# Altium schematic sheet wifi_watering_system_1.SchDoc
size A4
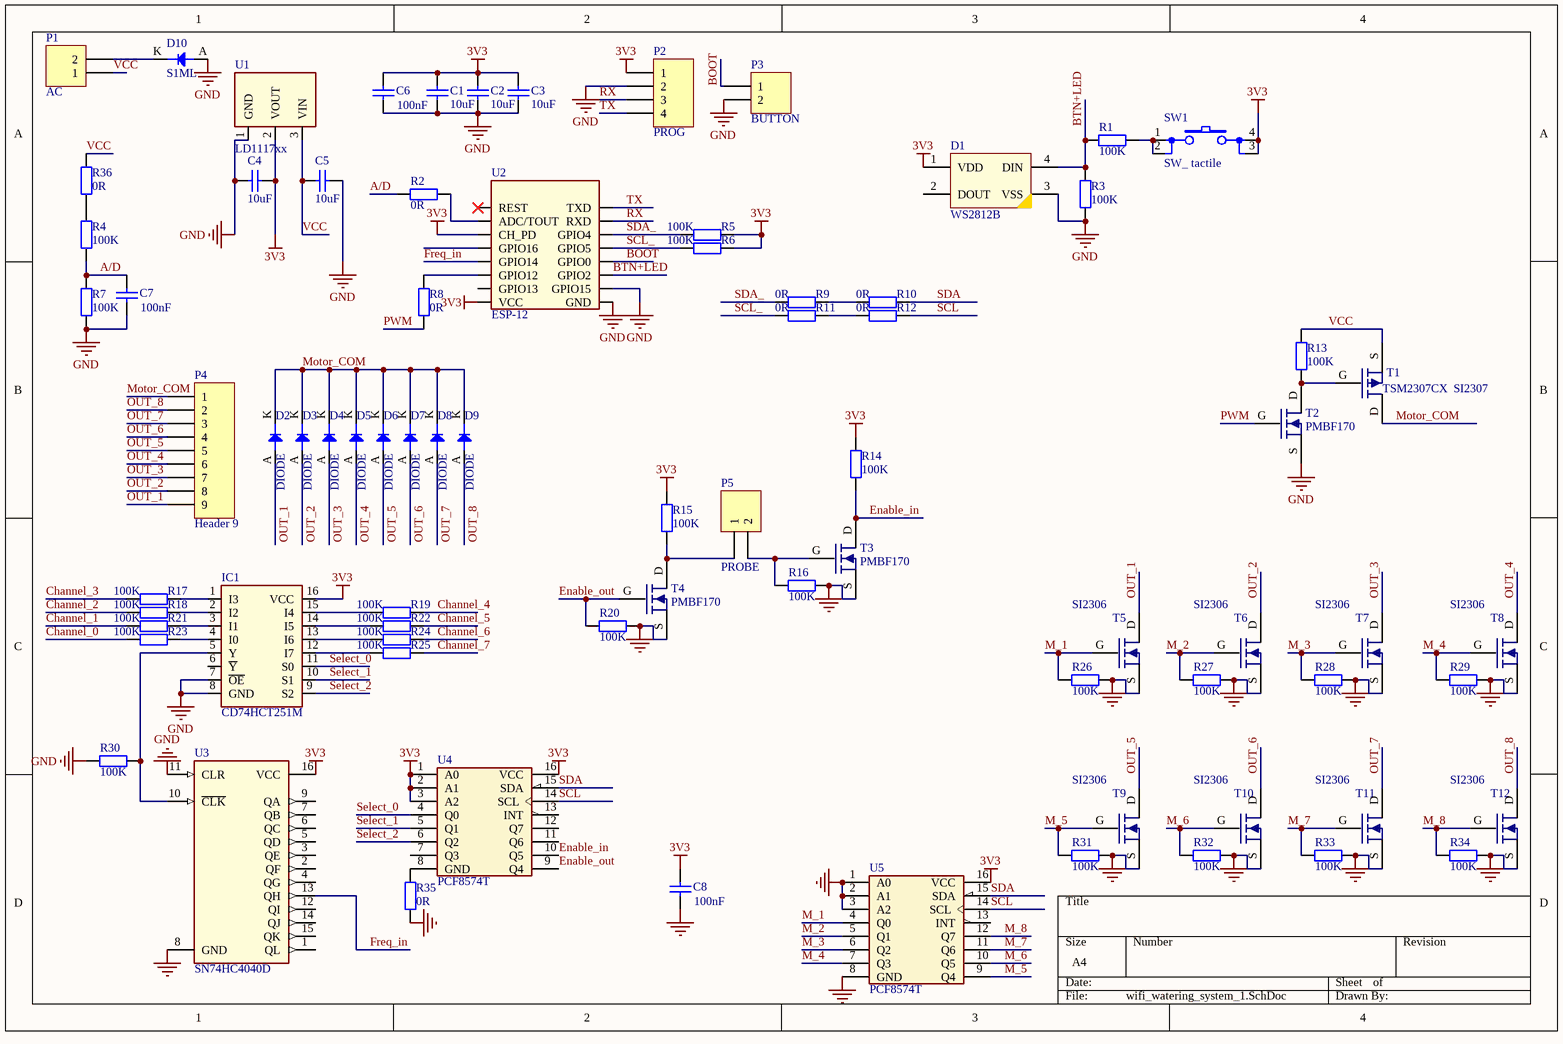
[diagram p0: wifi_watering_system_1.SchDoc]

## Parts
C1  10uF  [FP_1206_CAP_085]
C2  10uF  [FP_1206_CAP_085]
C3  10uF  [FP_1206_CAP_085]
C4  10uF  [FP_1206_CAP_085]
C5  10uF  [FP_1206_CAP_085]
C6  100nF  [FP_0603_CAP_080]
C7  100nF  [FP_0603_CAP_080]
C8  100nF  [FP_0603_CAP_080]
D1  WS2812B  [LED_5050_4pin]
D2  DIODE  [SOD-80]
D3  DIODE  [SOD-80]
D4  DIODE  [SOD-80]
D5  DIODE  [SOD-80]
D6  DIODE  [SOD-80]
D7  DIODE  [SOD-80]
D8  DIODE  [SOD-80]
D9  DIODE  [SOD-80]
D10  S1ML  [subsma]
IC1  CD74HCT251M  [GATE_SOIC16]
P1  AC  [Sorkapocs 2P 5mm]
P2  PROG  [HDR1X4]
P3  BUTTON  [HDR1X2]
P4  Header 9  [Sorkapocs 9P 5mm]
P5  PROBE  [HDR1X2]
R1  100K  [FP_0603_RES]
R2  0R  [FP_1206_RES]
R3  100K  [FP_0603_RES]
R4  100K  [FP_0603_RES]
R5  100K  [FP_0603_RES]
R6  100K  [FP_0603_RES]
R7  100K  [FP_0603_RES]
R8  0R  [FP_1206_RES]
R9  0R  [FP_1206_RES]
R10  0R  [FP_1206_RES]
R11  0R  [FP_1206_RES]
R12  0R  [FP_1206_RES]
R13  100K  [FP_0603_RES]
R14  100K  [FP_0603_RES]
R15  100K  [FP_0603_RES]
R16  100K  [FP_0603_RES]
R17  100K  [FP_0603_RES]
R18  100K  [FP_0603_RES]
R19  100K  [FP_0603_RES]
R20  100K  [FP_0603_RES]
R21  100K  [FP_0603_RES]
R22  100K  [FP_0603_RES]
R23  100K  [FP_0603_RES]
R24  100K  [FP_0603_RES]
R25  100K  [FP_0603_RES]
R26  100K  [FP_0603_RES]
R27  100K  [FP_0603_RES]
R28  100K  [FP_0603_RES]
R29  100K  [FP_0603_RES]
R30  100K  [FP_0603_RES]
R31  100K  [FP_0603_RES]
R32  100K  [FP_0603_RES]
R33  100K  [FP_0603_RES]
R34  100K  [FP_0603_RES]
R35  0R  [FP_1206_RES]
R36  0R  [FP_1206_RES]
SW1  SW_ tactile  [FP_TACTBTN]
T1  TSM2307CX  SI2307  [FET_SOT23]
T2  PMBF170  [FET_SOT23]
T3  PMBF170  [FET_SOT23]
T4  PMBF170  [FET_SOT23]
T5  SI2306  [FET_SOT23]
T6  SI2306  [FET_SOT23]
T7  SI2306  [FET_SOT23]
T8  SI2306  [FET_SOT23]
T9  SI2306  [FET_SOT23]
T10  SI2306  [FET_SOT23]
T11  SI2306  [FET_SOT23]
T12  SI2306  [FET_SOT23]
U1  LD1117xx  [SUPPLY_SOT223]
U2  ESP-12  [ESP_12]
U3  SN74HC4040D  [GATE_SOIC16]
U4  PCF8574T  [DIGITAL_SOIC16W]
U5  PCF8574T  [DIGITAL_SOIC16W]

## Nets
3V3: C1.2 C2.2 C3.2 C4.2 C6.1 C8.1 D1.1(VDD) IC1.16(VCC) P2.1 R5.1 R6.1 R14.2 R15.2 SW1.3 SW1.4 U1.2(VOUT) U2.3(CH_PD) U2.8(VCC) U3.16(VCC) U4.1(A0) U4.2(A1) U4.3(A2) U4.16(VCC) U5.16(VCC)
GND: C1.1 C2.1 C3.1 C4.1 C5.2 C6.2 C7.2 C8.2 D1.3(VSS) D10.A IC1.7(~{OE}) IC1.8(GND) P2.2 P3.2 R3.2 R7.2 R16.1 R20.1 R26.2 R27.1 R28.1 R29.1 R30.1 R31.1 R32.1 R33.1 R34.1 R35.2 T2.S T3.S T4.S T5.S T6.S T7.S T8.S T9.S T10.S T11.S T12.S U1.1(GND) U2.9(GND) U2.10(GPIO15) U3.8(GND) U3.11(CLR) U5.1(A0) U5.2(A1) U5.3(A2) U5.8(GND)
A/D: C7.1 R2.2 R4.2 R7.1
BOOT: P3.1 U2.12(GPIO0)
BTN+LED: D1.4(DIN) R1.1 R3.1 U2.11(GPIO2)
Channel_0: R23.1
Channel_1: R21.1
Channel_2: R18.1
Channel_3: R17.1
Channel_4: R19.2
Channel_5: R22.2
Channel_6: R24.2
Channel_7: R25.2
Enable_in: R14.1 T3.D U4.10(Q5)
Enable_out: R20.2 T4.G U4.9(Q4)
Freq_in: U2.5(GPIO14) U3.13(QH)
M_1: R26.1 T5.G U5.4(Q0)
M_2: R27.2 T6.G U5.5(Q1)
M_3: R28.2 T7.G U5.6(Q2)
M_4: R29.2 T8.G U5.7(Q3)
M_5: R31.2 T9.G U5.9(Q4)
M_6: R32.2 T10.G U5.10(Q5)
M_7: R33.2 T11.G U5.11(Q6)
M_8: R34.2 T12.G U5.12(Q7)
Motor_COM: D2.K D3.K D4.K D5.K D6.K D7.K D8.K D9.K P4.1 T1.D
OUT_1: D2.A P4.9 T5.D
OUT_2: D3.A P4.8 T6.D
OUT_3: D4.A P4.7 T7.D
OUT_4: D5.A P4.6 T8.D
OUT_5: D6.A P4.5 T9.D
OUT_6: D7.A P4.4 T10.D
OUT_7: D8.A P4.3 T11.D
OUT_8: D9.A P4.2 T12.D
PWM: R8.2 T2.G
RX: P2.3 U2.15(RXD)
SCL: R12.1 U4.14(SCL) U5.14(SCL)
SCL_: R6.2 R11.2 U2.13(GPIO5)
SDA: R10.1 U4.15(SDA) U5.15(SDA)
SDA_: R5.2 R9.2 U2.14(GPIO4)
Select_0: IC1.11(S0) U4.4(Q0)
Select_1: IC1.10(S1) U4.5(Q1)
Select_2: IC1.9(S2) U4.6(Q2)
TX: P2.4 U2.16(TXD)
VCC: C5.1 P1.1 R13.1 R36.1 T1.S U1.3(VIN)
NetD10_K: D10.K P1.2
NetIC1_1: IC1.1(I3) R17.2
NetIC1_2: IC1.2(I2) R18.2
NetIC1_3: IC1.3(I1) R21.2
NetIC1_4: IC1.4(I0) R23.2
NetIC1_5: IC1.5(Y) R30.2 U3.10(~{CLK})
NetIC1_12: IC1.12(I7) R25.1
NetIC1_13: IC1.13(I6) R24.1
NetIC1_14: IC1.14(I5) R22.1
NetIC1_15: IC1.15(I4) R19.1
NetP5_1: P5.1 R15.1 T4.D
NetP5_2: P5.2 R16.2 T3.G
NetR1_2: R1.2 SW1.1 SW1.2
NetR2_1: R2.1 U2.2(ADC/TOUT)
NetR4_1: R4.1 R36.2
NetR8_1: R8.1 U2.6(GPIO12)
NetR9_1: R9.1 R10.2
NetR11_1: R11.1 R12.2
NetR13_2: R13.2 T1.G T2.D
NetR35_1: R35.1 U4.8(GND)

Not connected (* = marked no-connect by the designer): D1 2(DOUT); IC1 6(~{Y}); U2 1(REST)* 4(GPIO16) 7(GPIO13); U3 1(QL) 2(QF) 3(QE) 4(QG) 5(QD) 6(QC) 7(QB) 9(QA) 12(QI) 14(QJ) 15(QK); U4 7(Q3) 11(Q6) 12(Q7) 13(INT); U5 13(INT)

## Library data of the parts
C1-C3 = Cap: Capacitor; Value: 100nF; Tûrés: 20% X7R; Order info: TODO; Published: 8-Jun-2000; LatestRevisionDate: 17-Jul-2002; LatestRevisionNote: Re-released for DXP Platform.; PackageReference: RAD-0.3; Publisher: Altium Limited; Order info: 82-07-81
C4 C5 = Cap: Capacitor; Value: 100nF; Tûrés: 20% X7R; Published: 8-Jun-2000; LatestRevisionDate: 17-Jul-2002; LatestRevisionNote: Re-released for DXP Platform.; PackageReference: RAD-0.3; Publisher: Altium Limited; Order info: 82-08-03
C6-C8 = Cap: Capacitor; Tûrés: 10%; Value: 100nF; Order info: 82-04-85
D10 = DIODE: Order info: 83-00-35
IC1 = CD74HCT251M: CD74HCT251M 8-INPUT MUX.WITH 3-STATE OUTP
P1 P3 P5 = Header 2: Header, 2-Pin; LatestRevisionDate: 17-Jul-2002; LatestRevisionNote: Re-released for DXP Platform.; Publisher: Altium Limited
P2 = Header 4: Header, 4-Pin; LatestRevisionDate: 17-Jul-2002; LatestRevisionNote: Re-released for DXP Platform.; Publisher: Altium Limited
P4 = Header 9: Header, 9-Pin; LatestRevisionDate: 17-Jul-2002; LatestRevisionNote: Re-released for DXP Platform.; Publisher: Altium Limited
R1 R3-R7 R13-R34 = RES: Resistor; Value: 100K; Order info: 81-10-50
R2 R8-R12 R35 R36 = RES: Resistor; Order info: TODO; Value: 0R
T1 = PMOS
T2-T12 = NMOS
  T2-T4: Order info: 86-01-96
  T5-T12: Order info: 86-01-57
U1 = LD1117xx: LD1117xx 3,3V lin reg; Order info: http://hu.mouser.com/ProductDetail/NXP/NX1117C33Z115/?qs=%2fha2pyFadui8%252bOpsKr9N%2fhvfdxjCMx%252bF0NTwqG%252bWOJY%3d
U2 = ESP-12: ESP-12 wifi module
U3 = SN74HC4040D: 12-Bit Asynchronous Binary Counter